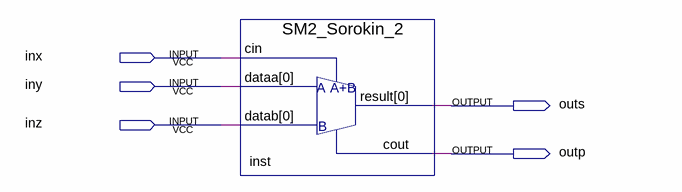
[diagram p0: schematic sheet]
// Quartus schematic CL_Project_Sorokin_Lab2_2.bdf as structural Verilog: 1 symbols, 5 pins
module CL_Project_Sorokin_Lab2_2 (
  input  inx,
  input  iny,
  input  inz,
  output outs,
  output outp
);

  SM2_Sorokin_2 inst (.cin(inx), .dataa(iny), .datab(inz), .result(outs), .cout(outp));
endmodule
